# Altium schematic sheet Transmitter.SchDoc
size 297 x 210 mm
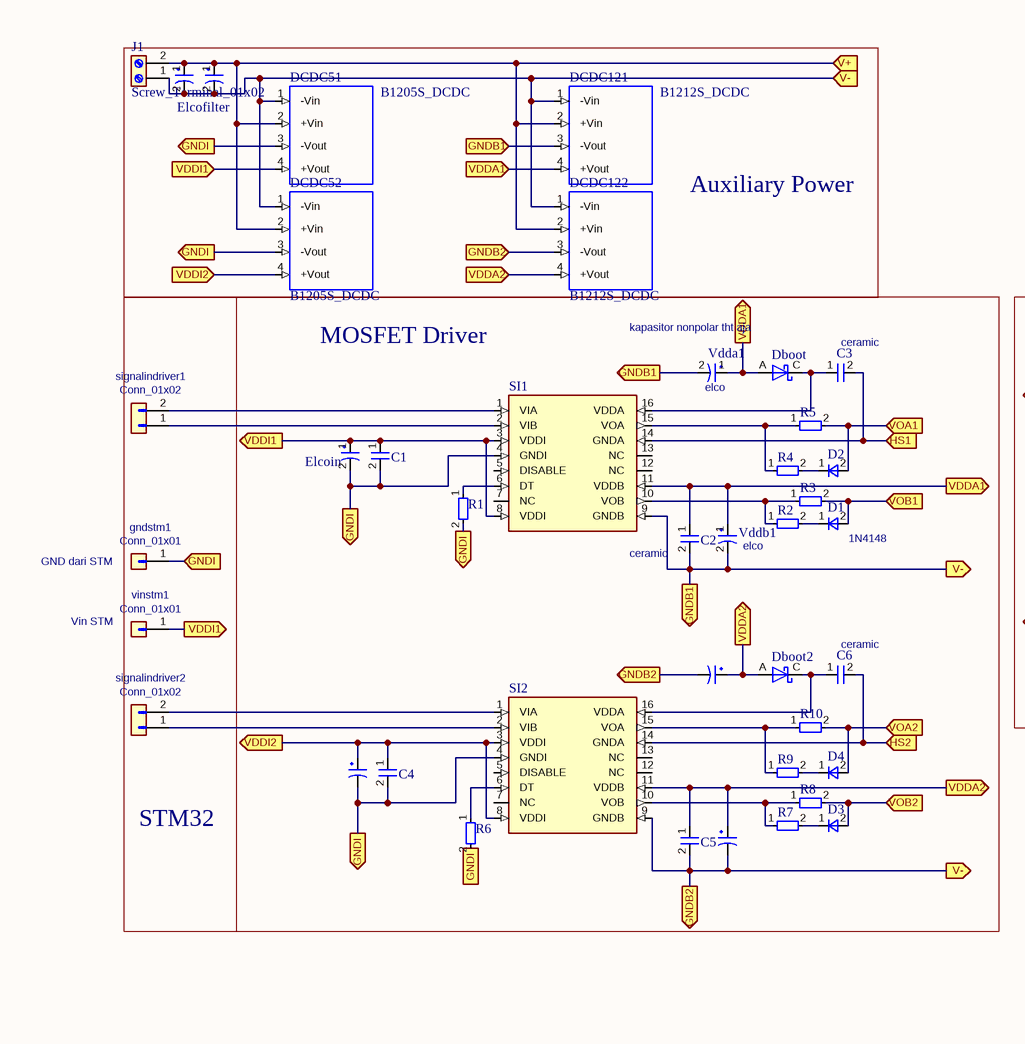
[diagram p0: Transmitter.SchDoc, left]
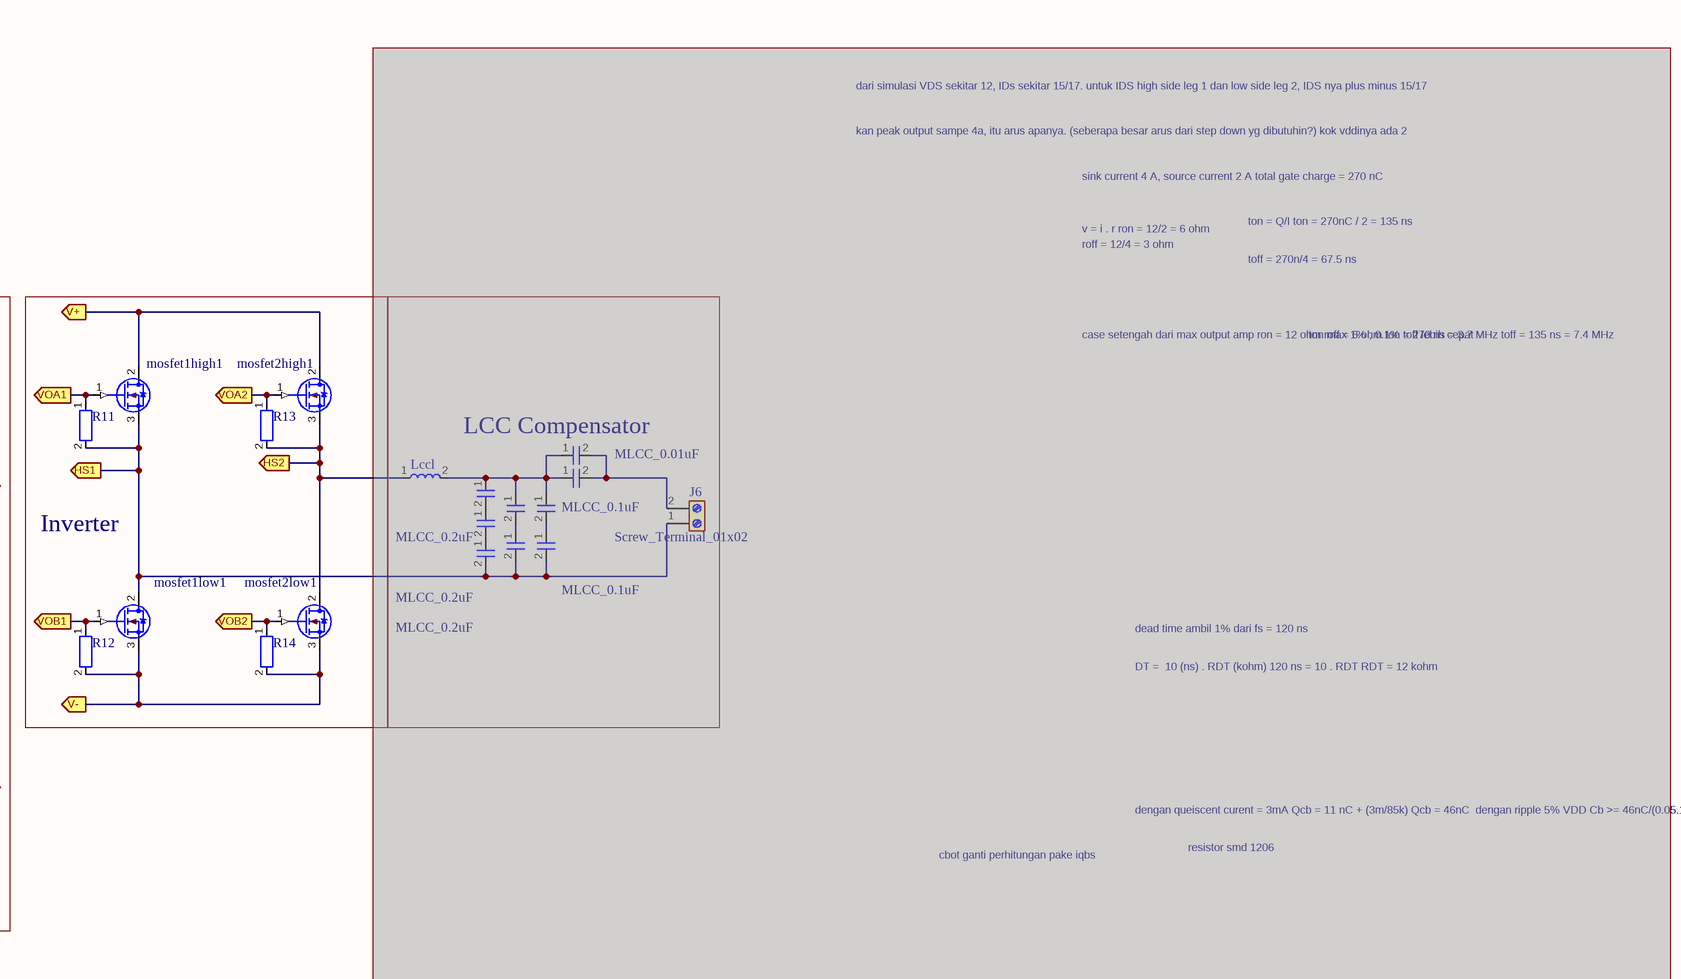
[diagram p1: Transmitter.SchDoc, right]

## Parts
(Parts that share a designator on the sheet are numbered #1, #2 ... from top to bottom, then left to right.)
C1  C_Small  [1206]  (value not drawn)
C2  C_Small  [1206]  (value not drawn)
C3  C_Small  [1206]  (value not drawn)
C4  C_Small  [1206]  (value not drawn)
C5  C_Small  [1206]  (value not drawn)
C6  C_Small  [1206]  (value not drawn)
Cin1  Elcofilter  [C820uf25V]  (value not drawn)
Cin2  Elcofilter  [C820uf25V]
CP1  MLCC_0.2uF  [MLCC2220_0.2uF]  (masked out: inside a compile mask, not in the netlist)
CP2  MLCC_0.1uF  [MLCC1206_0.1uF]  (masked out: inside a compile mask, not in the netlist)
CP3  MLCC_0.1uF  [MLCC1206_0.1uF]  (value not drawn)  (masked out: inside a compile mask, not in the netlist)
CP?#1  MLCC_0.2uF  [MLCC2220_0.2uF]  (masked out: inside a compile mask, not in the netlist)
CP?#2  MLCC_0.1uF  [MLCC1206_0.1uF]  (masked out: inside a compile mask, not in the netlist)
CP?#3  MLCC_0.1uF  [MLCC1206_0.1uF]  (value not drawn)  (masked out: inside a compile mask, not in the netlist)
CP?#4  MLCC_0.2uF  [MLCC2220_0.2uF]  (masked out: inside a compile mask, not in the netlist)
CS1  MLCC_0.01uF  [MLCC1825_0.01uF]  (masked out: inside a compile mask, not in the netlist)
CS2  MLCC_0.01uF  [MLCC1825_0.01uF]  (value not drawn)  (masked out: inside a compile mask, not in the netlist)
D1  D_Small  [DIO_LL4148]  (value not drawn)
D2  D_Small  [DIO_LL4148]  (value not drawn)
D3  D_Small  [DIO_LL4148]  (value not drawn)
D4  D_Small  [DIO_LL4148]  (value not drawn)
Dboot  D_Schottky  [Schottky]  (value not drawn)
Dboot2  D_Schottky  [Schottky]  (value not drawn)
DCDC51  B1205S_DCDC  [DCDC5V]
DCDC52  B1205S_DCDC  [DCDC5V]
DCDC121  B1212S_DCDC  [DCDC5V]
DCDC122  B1212S_DCDC  [DCDC5V]
elcodrover2  CP1_Small  [CP_Radial_D5.0mm_P2.50mm]  (value not drawn)
Elcoin  CP1_Small  [CP_Radial_D5.0mm_P2.50mm]  (value not drawn)
gndstm1  Conn_01x01  [PinHeader_1x01_P2.54mm_Vertical]
J1  Screw_Terminal_01x02  [Terminal]
J6  Screw_Terminal_01x02  [Terminal]  (masked out: inside a compile mask, not in the netlist)
Lccl  L  [Inductor]  (value not drawn)  (masked out: inside a compile mask, not in the netlist)
mosfet1high1  Q_NMOS_GDS  [MOSFET]  (value not drawn)
mosfet1low1  Q_NMOS_GDS  [MOSFET]  (value not drawn)
mosfet2high1  Q_NMOS_GDS  [MOSFET]  (value not drawn)
mosfet2low1  Q_NMOS_GDS  [MOSFET]  (value not drawn)
R1  R_Small  [1206]  (value not drawn)
R2  R_Small  [1206]  (value not drawn)
R3  R_Small  [1206]  (value not drawn)
R4  R_Small  [1206]  (value not drawn)
R5  R_Small  [1206]  (value not drawn)
R6  R_Small  [1206]  (value not drawn)
R7  R_Small  [1206]  (value not drawn)
R8  R_Small  [1206]  (value not drawn)
R9  R_Small  [1206]  (value not drawn)
R10  R_Small  [1206]  (value not drawn)
R11  R  [1206]  (value not drawn)
R12  R  [1206]  (value not drawn)
R13  R  [1206]  (value not drawn)
R14  R  [1206]  (value not drawn)
SI1  Si8233  [Si8233]  (value not drawn)
SI2  Si8233  [Si8233]  (value not drawn)
signalindriver1  Conn_01x02  [PinHeader_1x02_P2.54mm_Vertical]
signalindriver2  Conn_01x02  [PinHeader_1x02_P2.54mm_Vertical]
Vdda1  CP1_Small  [CP_Radial_D5.0mm_P2.50mm]  (value not drawn)
vddadriver2  CP1_Small  [CP_Radial_D5.0mm_P2.50mm]  (value not drawn)
Vddb1  CP1_Small  [CP_Radial_D5.0mm_P2.50mm]  (value not drawn)
vddb2elco1  CP1_Small  [CP_Radial_D5.0mm_P2.50mm]  (value not drawn)
vinstm1  Conn_01x01  [PinHeader_1x01_P2.54mm_Vertical]

## Blocks framed on the sheet
Auxiliary Power: Cin1 Cin2 DCDC51 DCDC52 DCDC121 DCDC122 J1
MOSFET Driver: C1-C6 D1-D4 Dboot Dboot2 elcodrover2 Elcoin R1-R10 SI1 SI2 Vdda1 vddadriver2 Vddb1 vddb2elco1
STM32: gndstm1 signalindriver1 signalindriver2 vinstm1
Inverter: mosfet1high1 mosfet1low1 mosfet2high1 mosfet2low1 R11-R14
LCC Compensator: CP1-CP3 CP?#1-CP?#4 CS1 CS2 J6 Lccl

## Ports
GNDB1 (in), GNDB1 (out), GNDB2 (in), GNDB2 (out), GNDI (in), GNDI (out), HS1 (in), HS1 (out), HS2 (in), HS2 (out), V+ (in), V+ (out), V- (in), V- (out), VDDA1 (in), VDDA1 (out), VDDA2 (in), VDDA2 (out), VDDI1 (in), VDDI1 (out), VDDI2 (in), VDDI2 (out), VOA1 (in), VOA1 (out), VOA2 (in), VOA2 (out), VOB1 (in), VOB1 (out), VOB2 (in), VOB2 (out)

## Nets
GNDB1: C2.2 C5.2 Cin1.2 Cin2.2 DCDC51.1(-Vin) DCDC52.1(-Vin) DCDC121.1(-Vin) DCDC121.3(-Vout) DCDC122.1(-Vin) DCDC122.3(-Vout) J1.1(Pin_1) mosfet1low1.3(S) mosfet2low1.3(S) R12.2 R14.2 SI1.9(GNDB) SI2.9(GNDB) Vdda1.2 vddadriver2.2 Vddb1.2 vddb2elco1.2 ; port GNDB1, port GNDB2, port V-
GNDI: C1.2 C4.2 DCDC51.3(-Vout) DCDC52.3(-Vout) elcodrover2.2 Elcoin.2 gndstm1.1(Pin_1) R1.2 R6.2 SI1.4(GNDI) SI2.4(GNDI) ; port GNDI
HS1: C3.2 mosfet1high1.3(S) mosfet1low1.2(D) R11.2 SI1.14(GNDA) ; port HS1
HS2: C6.2 mosfet2high1.3(S) mosfet2low1.2(D) R13.2 SI2.14(GNDA) ; port HS2
V+: Cin1.1 Cin2.1 DCDC51.2(+Vin) DCDC52.2(+Vin) DCDC121.2(+Vin) DCDC122.2(+Vin) J1.2(Pin_2) mosfet1high1.2(D) mosfet2high1.2(D) ; port V+
VDDA1: C2.1 Dboot.A DCDC121.4(+Vout) SI1.11(VDDB) Vdda1.1 Vddb1.1 ; port VDDA1
VDDA2: C5.1 Dboot2.A DCDC122.4(+Vout) SI2.11(VDDB) vddadriver2.1 vddb2elco1.1 ; port VDDA2
VDDI1: C1.1 DCDC51.4(+Vout) Elcoin.1 SI1.3(VDDI) SI1.8(VDDI) vinstm1.1(Pin_1) ; port VDDI1
VDDI2: C4.1 DCDC52.4(+Vout) elcodrover2.1 SI2.3(VDDI) SI2.8(VDDI) ; port VDDI2
VOA1: D2.2(A) mosfet1high1.1(G) R5.2 R11.1 ; port VOA1
VOA2: D4.2(A) mosfet2high1.1(G) R10.2 R13.1 ; port VOA2
VOB1: D1.2(A) mosfet1low1.1(G) R3.2 R12.1 ; port VOB1
VOB2: D3.2(A) mosfet2low1.1(G) R8.2 R14.1 ; port VOB2
NetC3_1: C3.1 Dboot.C(K) SI1.16(VDDA)
NetC6_1: C6.1 Dboot2.C(K) SI2.16(VDDA)
NetD1_1: D1.1(K) R2.2
NetD2_1: D2.1(K) R4.2
NetD3_1: D3.1(K) R7.2
NetD4_1: D4.1(K) R9.2
NetR1_1: R1.1 SI1.6(DT)
NetR2_1: R2.1 R3.1 SI1.10(VOB)
NetR4_1: R4.1 R5.1 SI1.15(VOA)
NetR6_1: R6.1 SI2.6(DT)
NetR7_1: R7.1 R8.1 SI2.10(VOB)
NetR9_1: R9.1 R10.1 SI2.15(VOA)
NetSI1_1: SI1.1(VIA) signalindriver1.2(Pin_2)
NetSI1_2: SI1.2(VIB) signalindriver1.1(Pin_1)
NetSI2_1: SI2.1(VIA) signalindriver2.2(Pin_2)
NetSI2_2: SI2.2(VIB) signalindriver2.1(Pin_1)

Not connected (* = marked no-connect by the designer): SI1 5(DISABLE) 7(NC) 12(NC) 13(NC); SI2 5(DISABLE) 7(NC) 12(NC) 13(NC)

## Notes on the sheet
- dari simulasi VDS sekitar 12, IDs sekitar 15/17.
  untuk IDS high side leg 1 dan low side leg 2, IDS nya plus minus 15/17
- kan peak output sampe 4a, itu arus apanya. (seberapa besar arus dari step down yg dibutuhin?)
  kok vddinya ada 2
- sink current 4 A, source current 2 A
  total gate charge = 270 nC
- v = i . r
  ron = 12/2 = 6 ohm
- ton = Q/I
  ton = 270nC / 2 = 135 ns
- roff = 12/4 = 3 ohm
- toff = 270n/4 = 67.5 ns
- kapasitor nonpolar tht aja
- (near Vdda1) elco
- (near C3) ceramic
- case setengah dari max output amp
  ron = 12 ohm
  roff = 6 ohm
  ton = 270 ns = 3.7 MHz
  toff = 135 ns = 7.4 MHz
- ton max 1% , 0.1%
  toff lebih cepat
- (near D1) 1N4148
- (near gndstm1) GND dari STM
- (near vinstm1) Vin STM
- ceramic
- elco
- (near C6) ceramic
- dead time ambil 1% dari fs = 120 ns
- DT =  10 (ns) . RDT (kohm)
  120 ns = 10 . RDT
  RDT = 12 kohm
- dengan queiscent curent = 3mA
  Qcb = 11 nC + (3m/85k)
  Qcb = 46nC
  dengan ripple 5% VDD
  Cb >= 46nC/(0.05.12)
  Cb >= 77 nF
  Rb <= (1-0.5).12e-6/(5 . 10uF)
  Rb <= 0.114 ohm
- cbot ganti perhitungan pake iqbs
- resistor smd 1206
- 1
- 2
- 3
- 4
- 5
- 6
- A
- B
- C
- D
- Title:
- File: coba.sch
- Sheet: /
- KiCad E.D.A.  kicad (5.1.4)-1
- Size: A4
- Date:
- Rev:
- Id: 1/1

## Library data of the parts
elcodrover2 Elcoin Vdda1 vddadriver2 Vddb1 vddb2elco1 = CP1_Small
  elcodrover2 vddadriver2 vddb2elco1: Value: CP1_Small; Footprint: Capacitor_THT:CP_Radial_D5.0mm_P2.50mm
gndstm1 vinstm1 = Conn_01x01: Value: Conn_01x01; Footprint: Connector_PinHeader_2.54mm:PinHeader_1x01_P2.54mm_Vertical
signalindriver1 signalindriver2 = Conn_01x02: Value: Conn_01x02; Footprint: Connector_PinHeader_2.54mm:PinHeader_1x02_P2.54mm_Vertical